# EAGLE design QuadEncoder (EAGLE 6.4)
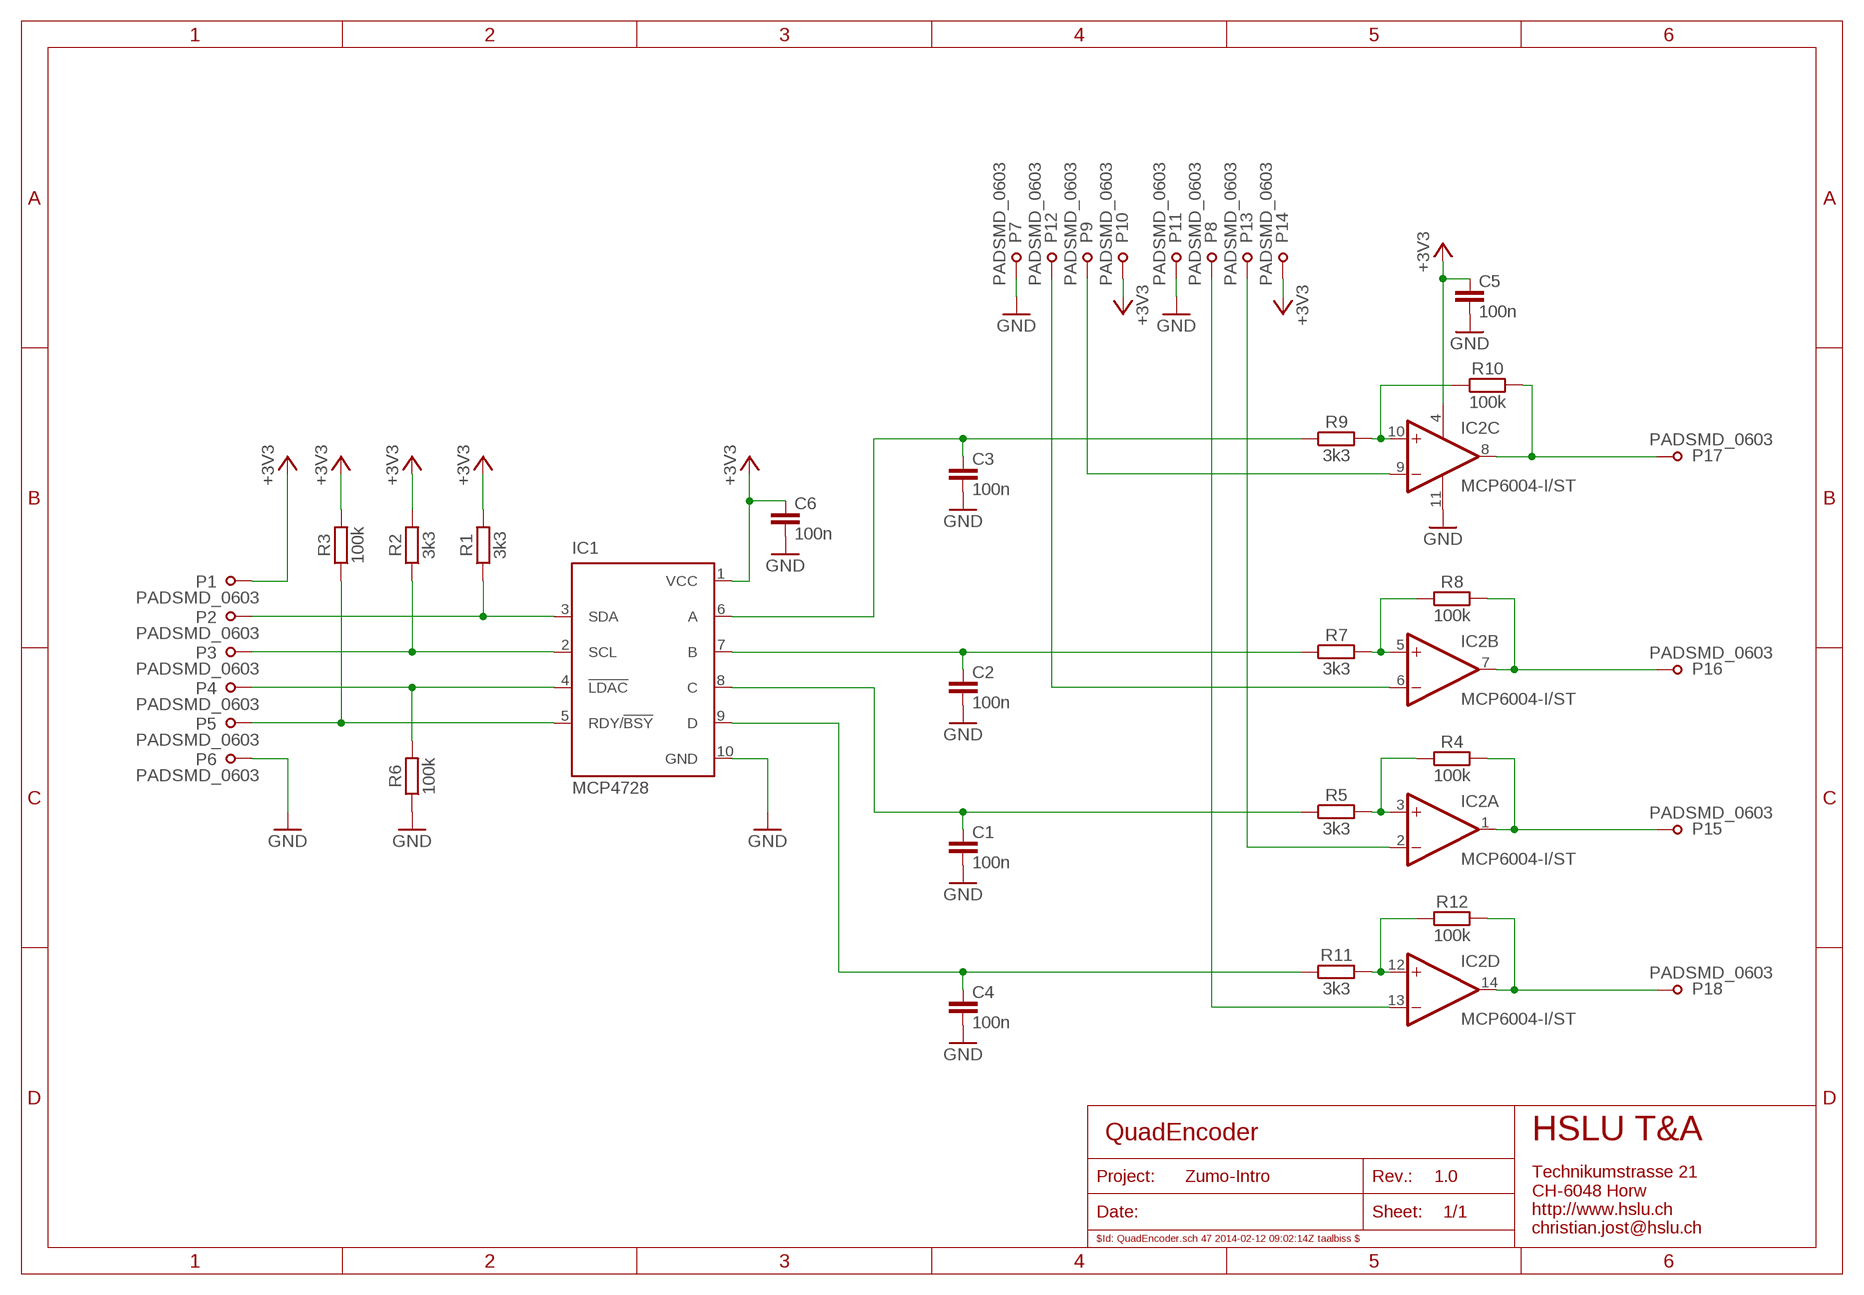
[diagram p0: schematic, sheet 1]

## Parts
C1  100n  C0805  [C0805-R]
C2  100n  C0805  [C0805-R]
C3  100n  C0805  [C0805-R]
C4  100n  C0805  [C0805-R]
C5  100n  C0805  [C0805-R]
C6  100n  C0805  [C0805-R]
IC1  MCP4728  [MSOP10]
IC2  MCP6004-I/ST  [TSSOP14]
P1  PADSMD_0603  [PAD_SMD_0603]
P2  PADSMD_0603  [PAD_SMD_0603]
P3  PADSMD_0603  [PAD_SMD_0603]
P4  PADSMD_0603  [PAD_SMD_0603]
P5  PADSMD_0603  [PAD_SMD_0603]
P6  PADSMD_0603  [PAD_SMD_0603]
P7  PADSMD_0603  [PAD_SMD_0603]
P8  PADSMD_0603  [PAD_SMD_0603]
P9  PADSMD_0603  [PAD_SMD_0603]
P10  PADSMD_0603  [PAD_SMD_0603]
P11  PADSMD_0603  [PAD_SMD_0603]
P12  PADSMD_0603  [PAD_SMD_0603]
P13  PADSMD_0603  [PAD_SMD_0603]
P14  PADSMD_0603  [PAD_SMD_0603]
P15  PADSMD_0603  [PAD_SMD_0603]
P16  PADSMD_0603  [PAD_SMD_0603]
P17  PADSMD_0603  [PAD_SMD_0603]
P18  PADSMD_0603  [PAD_SMD_0603]
R1  3k3  R0805  [R0805-R]
R2  3k3  R0805  [R0805-R]
R3  100k  R0805  [R0805-R]
R4  100k  R0805  [R0805-R]
R5  3k3  R0805  [R0805-R]
R6  100k  R0805  [R0805-R]
R7  3k3  R0805  [R0805-R]
R8  100k  R0805  [R0805-R]
R9  3k3  R0805  [R0805-R]
R10  100k  R0805  [R0805-R]
R11  3k3  R0805  [R0805-R]
R12  100k  R0805  [R0805-R]

## Nets
+3V3: C5.1 C6.1 IC1.1(VCC) IC2.4(V+) P1.1 P10.1 P14.1 R1.2 R2.2 R3.2
GND: C1.2 C2.2 C3.2 C4.2 C5.2 C6.2 IC1.10(GND) IC2.11(V-) P6.1 P7.1 P11.1 R6.1
N$1: IC1.3(SDA) P2.1 R1.1
N$2: IC1.2(SCL) P3.1 R2.1
N$3: IC1.4(!LDAC) P4.1 R6.2
N$4: IC1.5(RDY/!BSY) P5.1 R3.1
N$5: C1.1 IC1.8(C) R5.1
N$6: IC2.2(A:IN-) P13.1
N$7: IC2.1(A:OUT) P15.1 R4.2
N$8: IC2.3(A:IN+) R4.1 R5.2
N$9: IC2.12(D:IN+) R11.2 R12.1
N$10: IC2.5(B:IN+) R7.2 R8.1
N$11: IC2.7(B:OUT) P16.1 R8.2
N$12: IC2.6(B:IN-) P12.1
N$13: C2.1 IC1.7(B) R7.1
N$14: IC2.10(C:IN+) R9.2 R10.1
N$15: IC2.8(C:OUT) P17.1 R10.2
N$16: IC2.9(C:IN-) P9.1
N$17: C3.1 IC1.6(A) R9.1
N$18: IC2.14(D:OUT) P18.1 R12.2
N$19: IC2.13(D:IN-) P8.1
N$20: C4.1 IC1.9(D) R11.1

## Notes on the sheet
- QuadEncoder
- Zumo-Intro | 1.0

## Library data of the parts
C1-C6 = passive:C: Capacitor
IC1 = hslu_misc:MCP4728: 12-Bit, Quad DAC with EEPROM Memory; DISTRIBUTOR: Mouser; DISTRIBUTOR_NR: 579-MCP4728-E/UN
IC2 = hslu_misc:MCP6004; DISTRIBUTOR: Mouser; DISTRIBUTOR_NR: 579-MCP6004-I/ST
P1-P18 = hslu_misc:PAD: Solderpad
R1-R12 = passive:R: Resistor

## Board
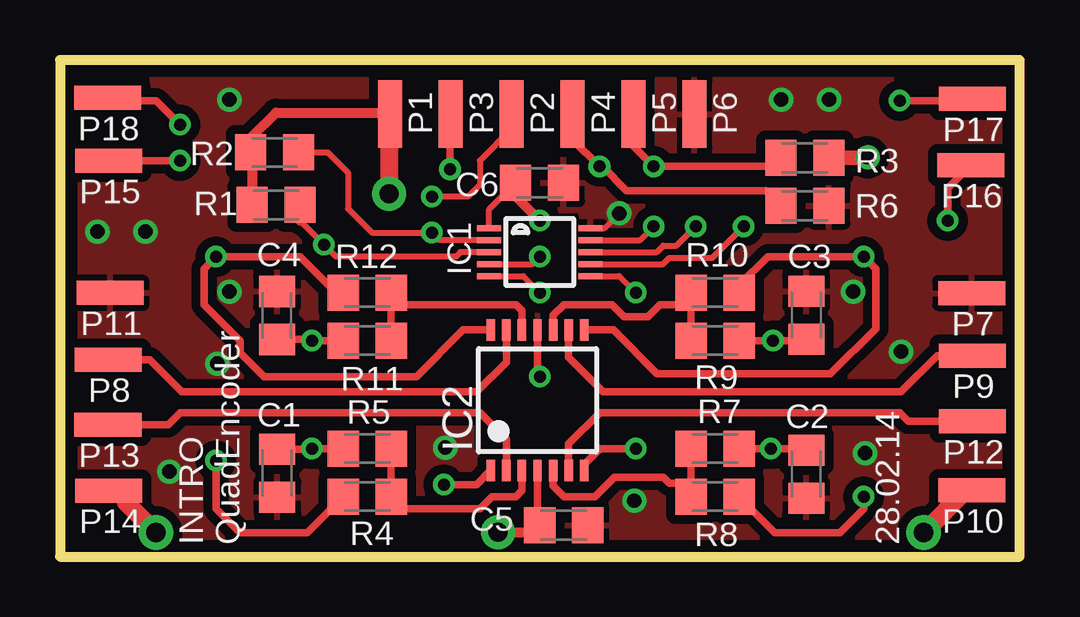
[diagram p1: board, top side]
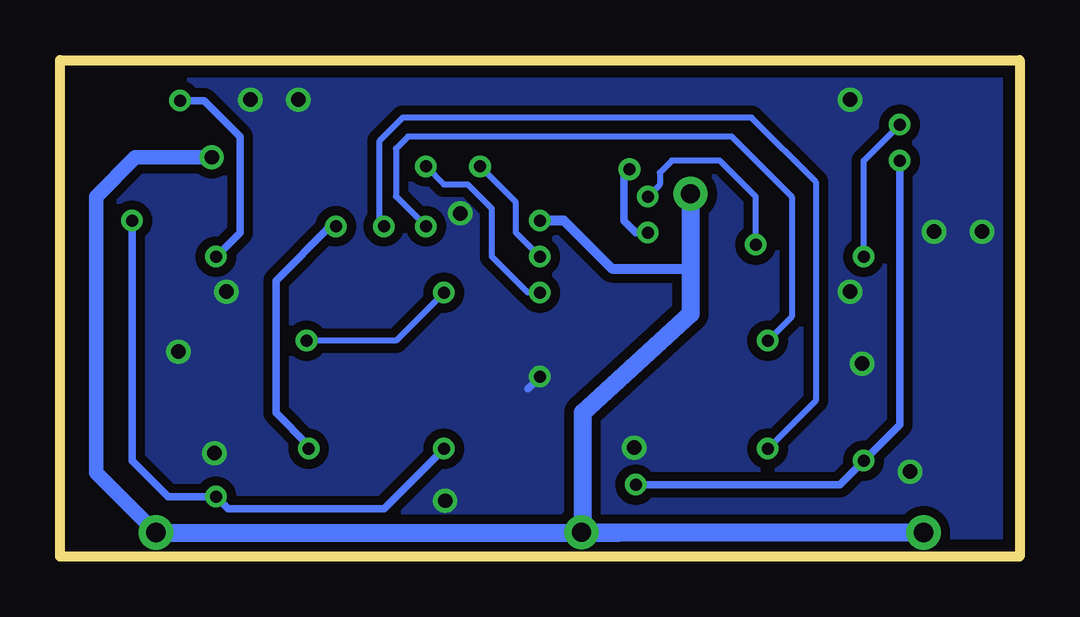
[diagram p2: board, bottom side, seen from below]

Size 40 x 20.69 mm. Coordinates in mm from the lower left corner, seen from the top.
Outline: 0,0 40,0 40,20.69 0,20.69 0,0
Copper layers (1*16): Top 0.035mm / dielectric 1.5mm / Bottom 0.035mm
Design rules "default *": minimum track width 0.25mm, minimum drill 0.5mm, track to track 10mil, track to pad 10mil, pad to pad 10mil, via to via 10mil, smd to smd 8mil, copper to edge 20mil, drill to drill 8mil, minimum pad ring 10mil, minimum via ring 8mil, stop-mask expansion 4mil, vias tented up to drill 0mil, thermal gap 10mil

### Footprints (pad centres in the part's own frame; a part is rotated, then mirrored left to right if it is on the bottom)
C0805-R = smd 1.3 x 1.5: 1 -1,0; 2 1,0
MSOP10 = smd 0.25 x 1: 1 -1,-2.113; 2 -0.5,-2.113; 3 0,-2.113; 4 0.5,-2.113; 5 1,-2.113; 6 1,2.113; 7 0.5,2.113; 8 0,2.113; 9 -0.5,2.113; 10 -1,2.113
TSSOP14 = smd 0.35 x 0.9: 1 -1.95,-2.925; 2 -1.3,-2.925; 3 -0.65,-2.925; 4 0,-2.925; 5 0.65,-2.925; 6 1.3,-2.925; 7 1.95,-2.925; 8 1.95,2.925; 9 1.3,2.925; 10 0.65,2.925; 11 0,2.925; 12 -0.65,2.925; 13 -1.3,2.925; 14 -1.95,2.925
PAD_SMD_0603 = smd 2.794 x 1: 1 0.039,0
R0805-R = smd 1.3 x 1.5: 1 -1,0; 2 1,0

### Placement (x,y rotation side)
C1  9.06,3.48 270 top
C2  31.11,3.43 270 top
C3  31.11,10.06 90 top
C4  9.04,10.05 90 top
C5  21,1.31 0 top
C6  19.99,15.57 0 top
IC1  20,12.69 270 top
IC2  19.91,6.52 0 top
P1  13.75,18.48 270 top
P2  18.83,18.48 270 top
P3  16.29,18.48 270 top
P4  21.37,18.48 270 top
P5  23.91,18.48 270 top
P6  26.45,18.48 270 top
P7  38.05,10.98 180 top
P8  2.05,8.21 180 top
P9  38.07,8.37 180 top
P10  38.05,2.75 180 top
P11  2.13,10.99 180 top
P12  38.07,5.63 180 top
P13  2.04,5.5 180 top
P14  2.07,2.75 180 top
P15  2.08,16.49 180 top
P16  38,16.31 180 top
P17  38.06,19.07 180 top
P18  2.02,19.11 180 top
R1  9.01,14.65 180 top
R2  8.95,16.84 180 top
R3  31.05,16.62 0 top
R4  12.81,2.5 180 top
R5  12.81,4.5 0 top
R6  31.05,14.62 180 top
R7  27.31,4.5 180 top
R8  27.31,2.5 0 top
R9  27.31,9 180 top
R10  27.31,11 0 top
R11  12.81,9 0 top
R12  12.81,11 180 top

### Tracks (layer width: path | path; a pad name or v marks a point on that pad's centre or on a via)
+3V3  (via drill 0.5, 0.6, 0.8 pad 1.42)
  Top 0.254: IC1.1 17.89,14.47 C6.1
  Top 0.305: 19.53,1.78 19.66,1.66 | 19.66,1.66 C5.1 | 20.03,1.47 20.5,1 20.31,1 C5.1 | 20.03,1.34 C5.1 | IC2.4 19.91,1.91 19.66,1.66
  Top 0.406: v18.26,1.02 19.71,1.02 C5.1 | 8.01,16.77 R2.2 7.95,16.87 | C6.1 18.99,15.01 v20,14 | 8.01,16.77 8.01,17.51 9,18.5 13.69,18.5 P1.1 | 8.01,16.77 R1.2
  Top 0.61: R3.2 33.65,16.62 v33.67,16.64
  Top 0.75: P1.1 13.72,18.44 v13.72,15.11 | 19.96,1.27 C5.1 | P14.1 2.75,2.75 2.75,2.25 v4,1 | P10.1 37.75,2.75 v36,1
  Bottom 0.406: 13.83,15 v13.72,15.11 | 13.72,12 17,12 19,14 v20,14
  Bottom 0.61: v36,1 38.5,3.5 38.5,15 36.86,16.64 v33.67,16.64
  Bottom 0.75: v13.72,15.11 13.72,12 13.72,10.11 18.22,6 18.22,1.22 v18.26,1.02 | v36,1 16.65,1 v18.26,1.02 | v4,1 16.49,1 v18.26,1.02
GND  (via drill 0.5, 0.6)
  Top 0.254: IC1.10 22.7,13.69 v23.31,14.3
  Top 0.305: IC2.11 19.91,7.59 v20,7.5
  Bottom 0.305: v20,7.5 20.5,7
  other vias: 30.07,19.04 32.06,19.04 1.56,13.54 3.56,13.54 7.07,19.04 35.06,8.54 33.56,4.31 16.07,4.54 4.57,3.54 23.94,2.33 7.07,11.04 33.06,11.04 6.57,8.04
  pour Bottom (isolate 0.381): -0.01,20.35 40,20.35 40,0 -0.01,0
  pour Top (isolate 0.381): -0.01,20.6 40,20.35 40,0 -0.01,0.25
N$1  (via drill 0.5, 0.5 pad 0.61)
  Top 0.254: 18.83,17.83 17.5,16.5 17.5,15.5 17,15 v15.5,15 | 10,14 v11,13 11.5,12.5 16.5,12.5 16.69,12.69 IC1.3
  Top 0.406: P2.1 18.83,17.83 | 10,14 10,14.64 R1.1
  Bottom 0.254: v11,13 11,15 12.5,16.5 14.5,16.5 15,16 15,15.5 v15.5,15
N$2  (via drill 0.5)
  Top 0.25: P3.1 16.36,18.48
  Top 0.254: IC1.2 15.81,13.19 v15.5,13.5 13,13.5 12,14.5 12,16 11.16,16.84 R2.1
  Top 0.305: v16.26,16.14 16.26,18.41 P3.1
  Bottom 0.305: v15.5,13.5 16,13.5 16.5,14 16.5,15.89 v16.26,16.14
N$3  (via drill 0.5)
  Top 0.254: IC1.4 19.69,12.19 v20,12.5
  Top 0.305: 29.93,14.5 R6.2 29.43,15.24 23.62,15.24 22.61,16.25 v22.49,16.25 21.37,17.38 21.37,17.63
  Top 0.406: P4.1 21.37,17.63
  Bottom 0.254: v20,12.5 21,13.5 21,14.76 v22.49,16.25
N$4  (via drill 0.5)
  Top 0.254: IC1.5 19.31,11.69 v20,11
  Top 0.305: P5.1 23.91,17.09 v24.75,16.25 29.68,16.25 R3.1
  Bottom 0.254: v20,11 20.5,11 22,12.5 22,14.5 23,15.5 23.99,15.5 v24.75,16.25
N$5  (via drill 0.5)
  Top 0.254: IC1.8 24.88,12.69 25.15,12.95 25.7,12.95 v26.5,13.75 | 10.48,4.48 v10.5,4.5
  Top 0.305: v10.5,4.5 R5.1 | C1.1 10.48,4.48
  Bottom 0.254: v10.5,4.5 8.5,6.5 8.5,15.61 11.18,18.29 25.71,18.29 26.67,17.33 26.67,13.97 26.5,13.8 v26.5,13.75
N$6
  Top 0.305: P13.1 4.5,5.5 5,6 17.5,6 18.61,4.89 IC2.2
N$7  (via drill 0.5)
  Top 0.305: v5,16.5 4.99,16.49 P15.1 | v6.5,4 6.5,2 7.5,1 10.31,1 R4.2 | v16,3 17.36,3 IC2.1
  Bottom 0.305: v5,16.5 5,5.5 v6.5,4 7.5,3 v16,3
N$8
  Top 0.305: IC2.3 19.25,2.75 19,2.5 18,2.5 17.5,2 14.31,2 R4.1 R5.2
N$9
  Top 0.305: R11.2 R12.1 14.31,10.5 19,10.5 19.25,10.24 IC2.12
N$10
  Top 0.305: IC2.5 20.55,2.94 21,2.5 22.31,2.5 23.11,3.3 25.15,3.3 25.4,3.05 26.31,3.05 | R8.1 26.31,3.05 | 26.31,3.05 R7.2
N$11  (via drill 0.5)
  Top 0.305: v33.5,2.5 33.5,2 32.5,1 29.81,1 R8.2 | 37.31,16.31 P16.1 37,15.35 v37,14 | IC2.7 21.86,3.85 22.5,4.5 v24,4.5
  Bottom 0.305: v37,14 37,4 35.5,2.5 v33.5,2.5 33,2 26.5,2 v24,4.5
N$12
  Top 0.305: P12.1 35.37,5.63 35,6 22.5,6 21.2,4.71 IC2.6
N$13  (via drill 0.5)
  Top 0.254: IC1.7 25.14,12.19 25.4,12.45 27.19,12.45 v28.5,13.75
  Top 0.305: C2.1 31.04,4.5 v29.63,4.5 R7.1
  Bottom 0.254: v28.5,13.75 28.75,13.75
  Bottom 0.305: 28.75,13.75 31,11.5 31,6 29.63,4.63 v29.63,4.5
N$14
  Top 0.305: 25.81,10.5 R10.1 26.31,10.5 | R9.2 26.31,10.5 | IC2.10 20.55,10.05 21,10.5 23,10.5 23.5,10 24.5,10 25,10.5 26.31,10.5
N$15  (via drill 0.5)
  Top 0.305: R10.2 28.31,11.31 29.5,12.5 v33.5,12.5 34,12 34,9.5 32.12,7.62 24.89,7.62 23.07,9.44 IC2.8 | v35,19 37.95,19 P17.1
  Bottom 0.305: v35,19 34,19 32.5,17.5 32.5,13.5 v33.5,12.5
N$16
  Top 0.305: IC2.9 21.2,8.29 22.64,6.86 35.05,6.86 36.57,8.37 P9.1
N$17  (via drill 0.5)
  Top 0.254: IC1.6 23.31,11.69 v24,11
  Top 0.305: R9.1 v29.72,9 31.05,9 C3.1
  Bottom 0.254: v24,11 26,9 v29.72,9
N$18  (via drill 0.5)
  Top 0.305: IC2.14 16.81,9.44 14.87,7.5 8.5,7.5 7.5,8.5 7.5,9 6,10.5 6,12 v6.5,12.5 10,12.5 11.5,11 R12.2 | P18.1 2.09,19 4,19 v5,18
  Bottom 0.254: v6.5,12.5 6.5,16.5 v5,18
N$19
  Top 0.305: IC2.13 18.61,8.11 17.36,6.86 5.08,6.86 3.73,8.21 P8.1
N$20  (via drill 0.5)
  Top 0.254: IC1.9 24.18,13.19 v24.75,13.75 | 10.45,9.05 v10.5,9
  Top 0.305: v10.5,9 R11.1 | C4.1 10.45,9.05
  Bottom 0.254: v10.5,9 9.5,10 9.5,15 12,17.5 25.5,17.5 26,17 26,15.01 v24.75,13.75
N$21
  cutout Top: 18.5,14.19 21.5,14.19 21.5,11.19 18.5,11.19
N$22
  cutout Top: 17.41,4.52 17.41,8.52 22.41,8.52 22.41,4.52

### Text on the board
tNames: INTRO / QuadEncoder | 28.02.14